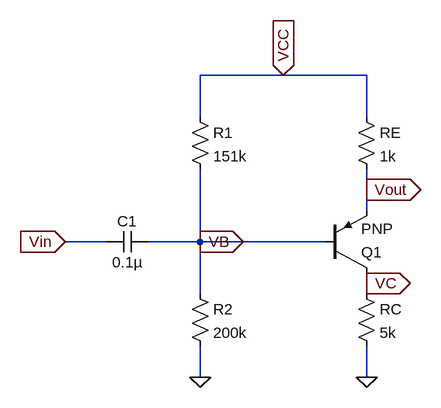
[diagram p0: schematic CED_pnp.asc]
CED_pnp.asc, the LTspice schematic file:
Version 4
SHEET 1 880 680
WIRE 336 32 208 32
WIRE 464 32 336 32
WIRE 208 96 208 32
WIRE 464 96 464 32
WIRE 464 208 464 176
WIRE 464 240 464 208
WIRE 64 288 0 288
WIRE 208 288 208 176
WIRE 208 288 128 288
WIRE 400 288 208 288
WIRE 464 352 464 336
WIRE 208 368 208 288
WIRE 464 368 464 352
WIRE 208 496 208 448
WIRE 464 496 464 448
FLAG 208 496 0
FLAG 464 496 0
FLAG 336 32 VCC
IOPIN 336 32 In
FLAG 0 288 Vin
IOPIN 0 288 In
FLAG 208 288 VB
IOPIN 208 288 Out
FLAG 464 208 Vout
IOPIN 464 208 Out
FLAG 464 352 VC
IOPIN 464 352 Out
SYMBOL Res 192 80 R0
SYMATTR InstName R1
SYMATTR Value 151k
SYMBOL Res 192 352 R0
SYMATTR InstName R2
SYMATTR Value 200k
SYMBOL Res 448 80 R0
SYMATTR InstName RE
SYMATTR Value 1k
SYMBOL Cap 128 272 R90
WINDOW 0 0 32 VBottom 2
WINDOW 3 32 32 VTop 2
SYMATTR InstName C1
SYMATTR Value 0.1µ
SYMBOL pnp 400 336 M180
SYMATTR InstName Q1
SYMBOL Res 448 352 R0
SYMATTR InstName RC
SYMATTR Value 5k

The netlist it stands for:
* CED_pnp.asc
R1 VCC VB 151k
R2 VB 0 200k
RE VCC Vout 1k
C1 VB Vin 0.1µ
Q1 VC VB Vout 0 PNP
RC VC 0 5k
.model NPN NPN
.model PNP PNP
.lib standard.bjt
.backanno
.end